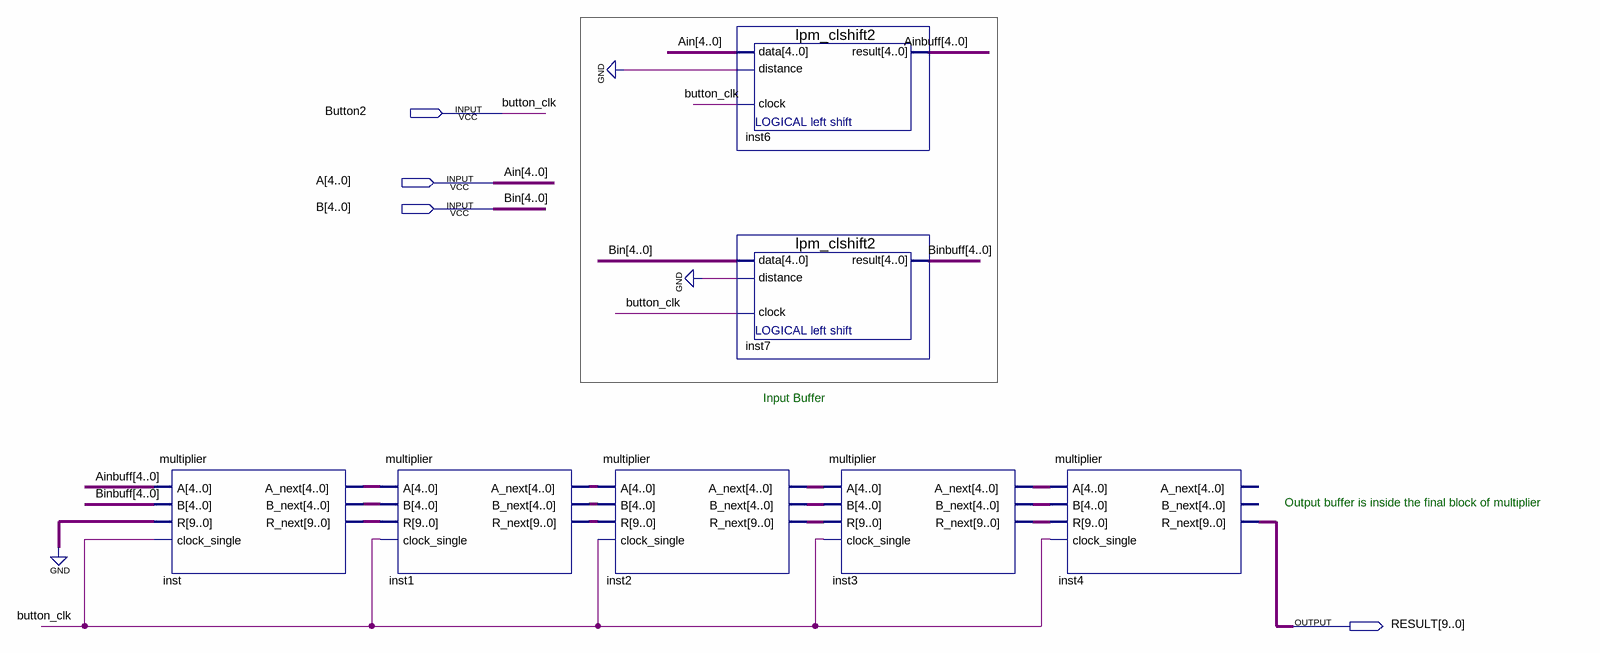
[diagram p0: schematic sheet]
// Quartus schematic 5multiplier.bdf as structural Verilog: 7 symbols, 4 pins
module \5multiplier  (
  input  Button2,
  input  [4:0] A,
  input  [4:0] B,
  output [9:0] RESULT
);

  wire [4:0] Ainbuff, Binbuff, inst1_a_next, inst1_b_next, inst2_a_next, inst2_b_next, inst3_a_next,
       inst3_b_next, inst_a_next, inst_b_next;
  wire [9:0] inst1_r_next, inst2_r_next, inst3_r_next, inst_r_next;

  multiplier inst (
    .A(Ainbuff), .B(Binbuff), .R({10{1'b0}}), .clock_single(Button2), .A_next(inst_a_next),
    .B_next(inst_b_next), .R_next(inst_r_next));
  multiplier inst1 (
    .A(inst_a_next), .B(inst_b_next), .R(inst_r_next), .clock_single(Button2), .A_next(inst1_a_next),
    .B_next(inst1_b_next), .R_next(inst1_r_next));
  multiplier inst2 (
    .A(inst1_a_next), .B(inst1_b_next), .R(inst1_r_next), .clock_single(Button2), .A_next(inst2_a_next),
    .B_next(inst2_b_next), .R_next(inst2_r_next));
  lpm_clshift2 inst6 (.data(A), .distance(1'b0), .clock(Button2), .result(Ainbuff));
  lpm_clshift2 inst7 (.data(B), .distance(1'b0), .clock(Button2), .result(Binbuff));
  multiplier inst3 (
    .A(inst2_a_next), .B(inst2_b_next), .R(inst2_r_next), .clock_single(Button2), .A_next(inst3_a_next),
    .B_next(inst3_b_next), .R_next(inst3_r_next));
  multiplier inst4 (
    .A(inst3_a_next), .B(inst3_b_next), .R(inst3_r_next), .clock_single(Button2), .R_next(RESULT));  // open: A_next, B_next

  // Other names for the same wires on the sheet: Ain[4:0] = A; Bin[4:0] = B; button_clk = Button2

  // Notes on the sheet:
  //   Input Buffer
  //   Output buffer is inside the final block of multiplier
endmodule
